# Altium schematic sheet Block_Diagram.SchDoc
size A4
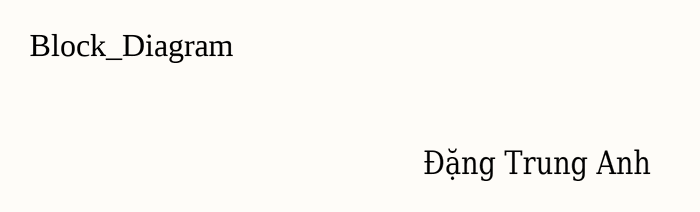
[diagram p0: Block_Diagram.SchDoc]

## Notes on the sheet
- Block_Diagram
- Đặng Trung Anh